# EAGLE schematic PCR_display_board (EAGLE 9.6.2)
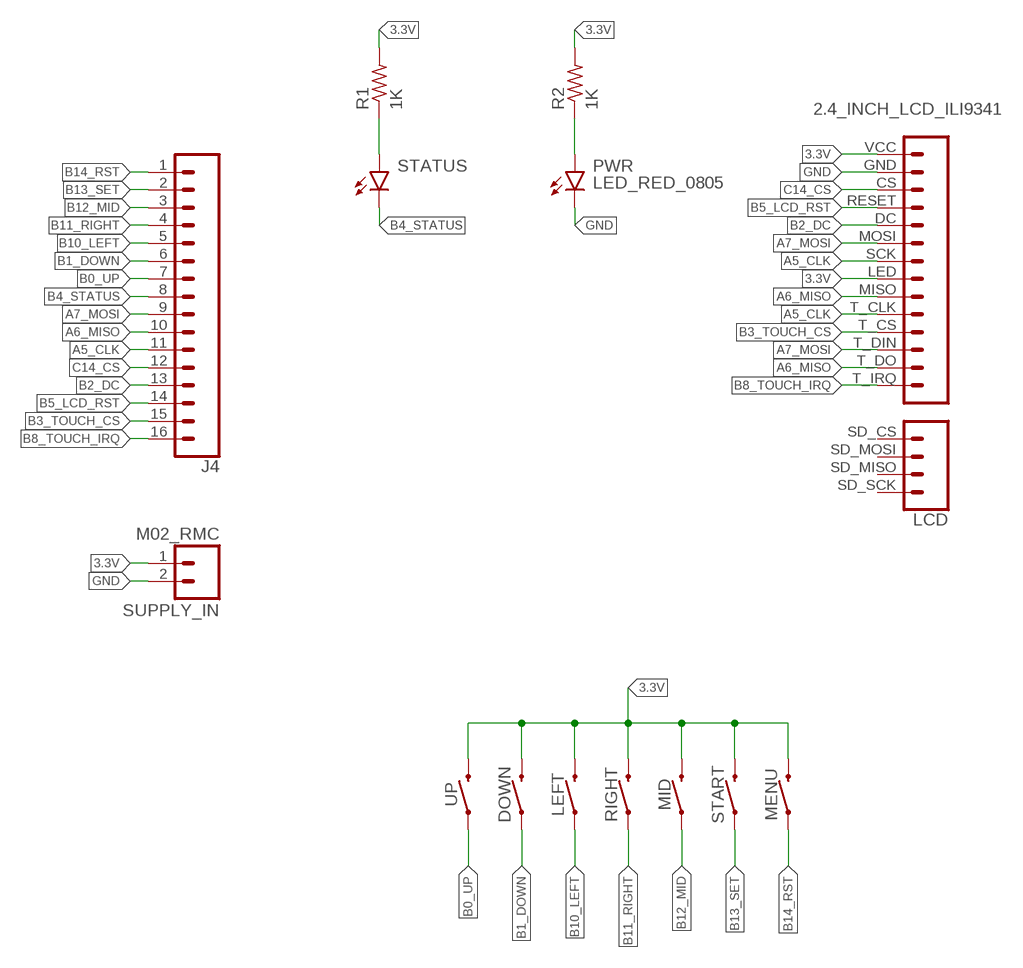
[diagram p0: schematic, sheet 1]

## Parts
DOWN  PUSH_SWITCH_MOM  [HDRRAR4W64P254_2X2_1016X736X556B]
J4  CONN_16  [1X16]
LCD  2.4_INCH_LCD_ILI9341  [XTAL1150X490X450N]
LEFT  PUSH_SWITCH_MOM  [HDRRAR4W64P254_2X2_1016X736X556B]
MENU  PUSH_SWITCH_MOM  [HDRRAR4W64P254_2X2_1016X736X556B]
MID  PUSH_SWITCH_MOM  [HDRRAR4W64P254_2X2_1016X736X556B]
PWR  LED_RED_0805  LED3MM  [LED3MM]
R1  1K  R-US_R0805  [R0805]
R2  1K  R-US_R0805  [R0805]
RIGHT  PUSH_SWITCH_MOM  [HDRRAR4W64P254_2X2_1016X736X556B]
START  PUSH_SWITCH_MOM  [HDRRAR4W64P254_2X2_1016X736X556B]
STATUS  LED3MM  [LED3MM]
SUPPLY_IN  M02_RMC  [M02_RMC]
UP  PUSH_SWITCH_MOM  [HDRRAR4W64P254_2X2_1016X736X556B]

## Nets
3.3V: DOWN.4 LCD.LED LCD.VCC LEFT.4 MENU.4 MID.4 R1.2 R2.2 RIGHT.4 START.4 SUPPLY_IN.1 UP.4
A5_CLK: J4.11 LCD.SCK LCD.T_CLK
A6_MISO: J4.10 LCD.MISO(SDO(MISO)) LCD.T_DO(T_D0)
A7_MOSI: J4.9 LCD.MOSI(SDI(MOSI)) LCD.T_DIN
B0_UP: J4.7 UP.1
B1_DOWN: DOWN.1 J4.6
B2_DC: J4.13 LCD.DC
B3_TOUCH_CS: J4.15 LCD.T_CS
B4_STATUS: J4.8 STATUS.K(C)
B5_LCD_RST: J4.14 LCD.RESET
B8_TOUCH_IRQ: J4.16 LCD.T_IRQ
B10_LEFT: J4.5 LEFT.1
B11_RIGHT: J4.4 RIGHT.1
B12_MID: J4.3 MID.1
B13_SET: J4.2 START.1
B14_RST: J4.1 MENU.1
C14_CS: J4.12 LCD.CS
GND: LCD.GND PWR.K(C) SUPPLY_IN.2
N$1: PWR.A R2.1
N$3: R1.1 STATUS.A
Unconnected: LCD.SD_CS LCD.SD_MISO LCD.SD_MOSI LCD.SD_SCK

## Library data of the parts
DOWN LEFT MENU MID RIGHT START UP = my_3D_components:PUSH_SWITCH_MOM
J4 = SparkFun-Connectors:CONN_16: Multi connection point. Often used as Generic Header-pin footprint for 0.1 inch spaced/style header connections On any of the 0.1 inch spaced packages, you can populate with these: Break Away Headers - Straight <https://www.sparkfun.com/products/116> (PRT-00116) Break Away Male Headers - Right Angle <https://www.sparkfun.com/products/553> (PRT-00553) Female Headers <https://www.sparkfun.com/products/115> (PRT-00115) Break Away Headers - Machine Pin <https://www.sparkfun.com/products/117> (PRT-00117) Break Away Female Headers - Swiss Machine Pin <https://www.sparkfun.com/products/743> (PRT-00743) For SCREWTERMINALS and SPRING TERMINALS visit here: Screw Terimnals on SparkFun.com <https://www.sparkfun.com/search/results?term=Screw+Terminals> (5mm/3.5mm/2.54mm spacing) This device is also useful as a general connection point to wire up your design to another part of your project. Our various solder wires solder well into these plated through hole pads. Hook-Up Wire - Assortment (Stranded, 22 AWG) <https://www.sparkfun.com/products/11375> (PRT-11375) Hook-Up Wire - Assortment (Solid Core, 22 AWG) <https://www.sparkfun.com/products/11367> (PRT-11367) View the entire wire category on our website here <https://www.sparkfun.com/categories/141> Special notes: Molex polarized connector foot print use with SKU : PRT-08231 with associated crimp pins and housings. 1MM SMD Version SKU: PRT-10208 NOTES ON THE VARIANTS LOCK and LOCK_LONGPADS... This footprint was designed to help hold the alignment of a through-hole component (i.e. 6-pin header) while soldering it into place. You may notice that each hole has been shifted either up or down by 0.005 of an inch from it's more standard position (which is a perfectly straight line). This slight alteration caused the pins (the squares in the middle) to touch the edges of the holes. Because they are alternating, it causes a "brace" to hold the component in place. 0.005 has proven to be the perfect amount of "off-center" position when using our standard breakaway headers. Although looks a little odd when you look at the bare footprint, once you have a header in there, the alteration is very hard to notice. Also,if you push a header all the way into place, it is covered up entirely on the bottom side.
LCD = my_3D_components:2.4_INCH_LCD_ILI9341
PWR STATUS = led:LED: LED OSRAM: - CHIPLED LG R971, LG N971, LY N971, LG Q971, LY Q971, LO R971, LY R971 LH N974, LH R974 LS Q976, LO Q976, LY Q976 LO Q996 - Hyper CHIPLED LW Q18S LB Q993, LB Q99A, LB R99A - SideLED LS A670, LO A670, LY A670, LG A670, LP A670 LB A673, LV A673, LT A673, LW A673 LH A674 LY A675 LS A676, LA A676, LO A676, LY A676, LW A676 LS A679, LY A679, LG A679 - Hyper Micro SIDELED® LS Y876, LA Y876, LO Y876, LY Y876 LT Y87S - SmartLED LW L88C, LW L88S LB L89C, LB L89S, LG L890 LS L89K, LO L89K, LY L89K LS L896, LA L896, LO L896, LY L896 - TOPLED LS T670, LO T670, LY T670, LG T670, LP T670 LSG T670, LSP T670, LSY T670, LOP T670, LYG T670 LG T671, LOG T671, LSG T671 LB T673, LV T673, LT T673, LW T673 LH T674 LS T676, LA T676, LO T676, LY T676, LB T676, LH T676, LSB T676, LW T676 LB T67C, LV T67C, LT T67C, LS T67K, LO T67K, LY T67K, LW E67C LS E67B, LA E67B, LO E67B, LY E67B, LB E67C, LV E67C, LT E67C LW T67C LS T679, LY T679, LG T679 LS T770, LO T770, LY T770, LG T770, LP T770 LB T773, LV T773, LT T773, LW T773 LH T774 LS E675, LA E675, LY E675, LS T675 LS T776, LA T776, LO T776, LY T776, LB T776 LHGB T686 LT T68C, LB T68C - Hyper Mini TOPLED® LB M676 - Mini TOPLED Santana® LG M470 LS M47K, LO M47K, LY M47K Source: http://www.osram.convergy.de LUXEON: - LUMILED® LXK2-PW12-R00, LXK2-PW12-S00, LXK2-PW14-U00, LXK2-PW14-V00 LXK2-PM12-R00, LXK2-PM12-S00, LXK2-PM14-U00 LXK2-PE12-Q00, LXK2-PE12-R00, LXK2-PE12-S00, LXK2-PE14-T00, LXK2-PE14-U00 LXK2-PB12-K00, LXK2-PB12-L00, LXK2-PB12-M00, LXK2-PB14-N00, LXK2-PB14-P00, LXK2-PB14-Q00 LXK2-PR12-L00, LXK2-PR12-M00, LXK2-PR14-Q00, LXK2-PR14-R00 LXK2-PD12-Q00, LXK2-PD12-R00, LXK2-PD12-S00 LXK2-PH12-R00, LXK2-PH12-S00 LXK2-PL12-P00, LXK2-PL12-Q00, LXK2-PL12-R00 Source: www.luxeon.com KINGBRIGHT: KA-3528ASYC Source: www.kingbright.com
R1 R2 = my_3D_components:R-US_: RESISTOR, American symbol; SPICEPREFIX: R
SUPPLY_IN = my_3D_components:M02_RMC